# Altium schematic sheet Elreg_Sender_Top.SchDoc
size A; SheetNumber: 1
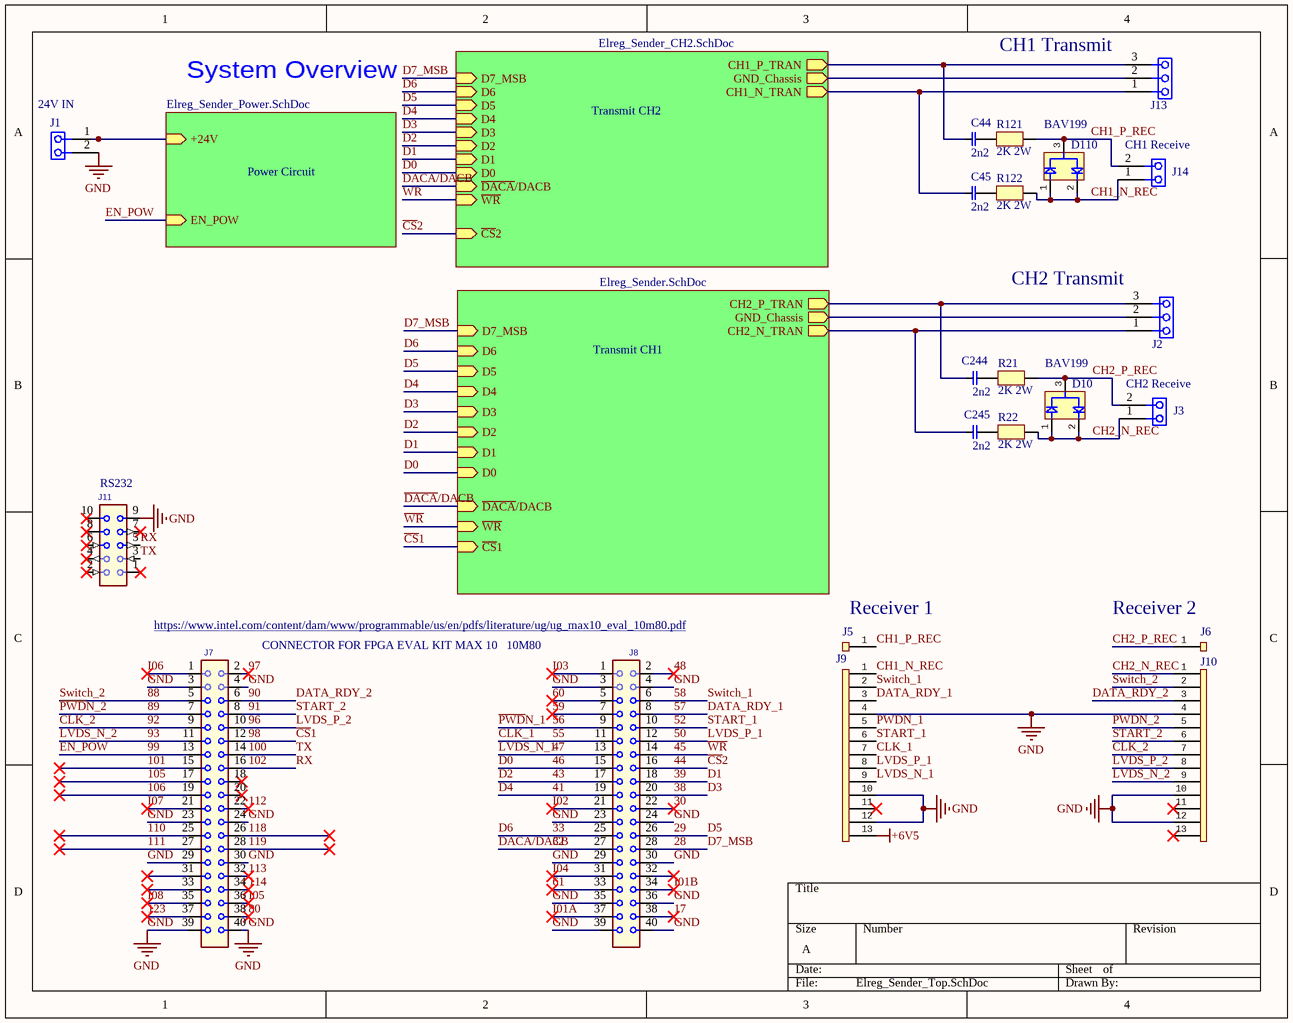
[diagram p0: Elreg_Sender_Top.SchDoc]

## Parts
C44  2n2  [CAP-1210]
C45  2n2  [CAP-1210]
C244  2n2  [CAP-1210]
C245  2n2  [CAP-1210]
D10  BAV199  [BAV199]
D110  BAV199  [BAV199]
J1  24V IN  [WAGO_2_pins]
J2  CONN 3x1  [WAGO-3_pins]  (value not drawn)
J3  CH2 Receive  [WAGO_2_pins]
J5  CON1_b  [CONN1 _b]  (value not drawn)
J6  CON1_b  [CONN1 _b]  (value not drawn)
J7  Header 2X20  [HEADER_2x20_2_54_1mm]  (value not drawn)
J8  Header 2X20  [HEADER_2x20_2_54_1mm]  (value not drawn)
J9  CON13  [CONN13]  (value not drawn)
J10  CON14  [CONN13]  (value not drawn)
J11  Header 2X5  [PIN-2X5-2.54-1.0]  (value not drawn)
J13  CONN 3x1  [WAGO-3_pins]  (value not drawn)
J14  CH1 Receive  [WAGO_2_pins]
R21  2K 2W  [RES2512]
R22  2K 2W  [RES2512]
R121  2K 2W  [RES2512]
R122  2K 2W  [RES2512]

## Sub-sheets
Power Circuit = Elreg_Sender_Power.SchDoc: +24V (in), EN_POW (in)
Transmit CH1 = Elreg_Sender.SchDoc: CH2_P_TRAN (out), CH2_N_TRAN (out), D0 (in), D1 (in), D2 (in), D3 (in), D4 (in), D5 (in), D6 (in), ~{CS}1 (in), ~{WR} (in), ~{DACA}/DACB (in), D7_MSB (in), GND_Chassis (out)
Transmit CH2 = Elreg_Sender_CH2.SchDoc: CH1_P_TRAN (out), CH1_N_TRAN (out), D0 (in), D1 (in), D2 (in), D3 (in), D4 (in), D5 (in), D6 (in), ~{WR} (in), ~{DACA}/DACB (in), D7_MSB (in), GND_Chassis (out), ~{CS}2 (in)

## Nets
+6V5: J9.13
GND: J1.2(Vout) J7.3(RX) J7.4(RTS) J7.23 J7.24 J7.29 J7.30 J7.39 J7.40 J8.3(RX) J8.4(RTS) J8.23 J8.24 J8.29 J8.30 J8.35 J8.36 J8.39 J8.40 J9.4 J9.10 J9.12 J10.4 J10.10 J10.12 J11.9(+PWR)
17: J8.38
28: J8.28 ; sheet Transmit CH1/D7_MSB, sheet Transmit CH2/D7_MSB  [also labelled D7_MSB]
29: J8.26 ; sheet Transmit CH1/D5, sheet Transmit CH2/D5  [also labelled D5]
30: J8.22
32: J8.27 ; sheet Transmit CH1/~{DACA}/DACB, sheet Transmit CH2/~{DACA}/DACB  [also labelled ~{DACA}/DACB]
33: J8.25 ; sheet Transmit CH1/D6, sheet Transmit CH2/D6  [also labelled D6]
38: J8.20 ; sheet Transmit CH1/D3, sheet Transmit CH2/D3  [also labelled D3]
39: J8.18 ; sheet Transmit CH1/D1, sheet Transmit CH2/D1  [also labelled D1]
41: J8.19 ; sheet Transmit CH1/D4, sheet Transmit CH2/D4  [also labelled D4]
43: J8.17 ; sheet Transmit CH1/D2, sheet Transmit CH2/D2  [also labelled D2]
44: J8.16 ; sheet Transmit CH2/~{CS}2  [also labelled ~{CS}2]
45: J8.14 ; sheet Transmit CH1/~{WR}, sheet Transmit CH2/~{WR}  [also labelled ~{WR}]
46: J8.15 ; sheet Transmit CH1/D0, sheet Transmit CH2/D0  [also labelled D0]
47: J8.13 J9.9  [also labelled LVDS_N_1]
48: J8.2(DSR)
50: J8.12 J9.8  [also labelled LVDS_P_1]
52: J8.10 J9.6  [also labelled START_1]
55: J8.11 J9.7  [also labelled CLK_1]
56: J8.9(+PWR) J9.5  [also labelled ~{PWD}N_1]
57: J8.8 J9.3  [also labelled DATA_RDY_1]
58: J8.6(CTS) J9.2  [also labelled Switch_1]
59: J8.7(DTR)
60: J8.5(TX)
61: J8.33
80: J7.38
88: J7.5(TX) J10.2  [also labelled Switch_2]
89: J7.7(DTR) J10.5  [also labelled ~{PWD}N_2]
90: J7.6(CTS) J10.3  [also labelled DATA_RDY_2]
91: J7.8 J10.6  [also labelled START_2]
92: J7.9(+PWR) J10.7  [also labelled CLK_2]
93: J7.11 J10.9  [also labelled LVDS_N_2]
96: J7.10 J10.8  [also labelled LVDS_P_2]
97: J7.2(DSR)
98: J7.12 ; sheet Transmit CH1/~{CS}1  [also labelled ~{CS}1]
99: J7.13 ; sheet Power Circuit/EN_POW  [also labelled EN_POW]
100: J7.14 J11.3(RX)  [also labelled TX]
101: J7.15
102: J7.16 J11.5(TX)  [also labelled RX]
105: J7.17
106: J7.19
110: J7.25
111: J7.27
112: J7.22
113: J7.32
114: J7.34
118: J7.26
119: J7.28
123: J7.37
CH1_N_REC: D110.1(GND) D110.2(GND) J9.1 J14.1(Vout) R122.1(G)
CH1_P_REC: D110.3(GND) J5.1 J14.2(Vout) R121.1(G)
CH2_N_REC: D10.1(GND) D10.2(GND) J3.1(Vout) J10.1 R22.1(G)
CH2_P_REC: D10.3(GND) J3.2(Vout) J6.1 R21.1(G)
I01A: J8.37
I01B: J8.34
I02: J8.21
I03: J8.1
I04: J8.31
I05: J7.36
I06: J7.1
I07: J7.21
I08: J7.35
NetC44_1: C44.1(G) J13.3(Vout) ; sheet Transmit CH2/CH1_P_TRAN
NetC44_2: C44.2(G) R121.2(G)
NetC45_1: C45.1(G) J13.1(Vout) ; sheet Transmit CH2/CH1_N_TRAN
NetC45_2: C45.2(G) R122.2(G)
NetC244_1: C244.1(G) J2.3(Vout) ; sheet Transmit CH1/CH2_P_TRAN
NetC244_2: C244.2(G) R21.2(G)
NetC245_1: C245.1(G) J2.1(Vout) ; sheet Transmit CH1/CH2_N_TRAN
NetC245_2: C245.2(G) R22.2(G)
NetJ1_1: J1.1(Vout) ; sheet Power Circuit/+24V
NetJ2_2: J2.2(Vout) ; sheet Transmit CH1/GND_Chassis
NetJ13_2: J13.2(Vout) ; sheet Transmit CH2/GND_Chassis

Not connected (* = marked no-connect by the designer): J7 18* 20* 31* 33*; J8 32*; J9 11(34)*; J10 11(34)* 13(36)*; J11 1* 2(DSR)* 4(RTS)* 6(CTS)* 7(DTR)* 8* 10*

## Notes on the sheet
- System Overview
- (near J13) CH1 Transmit
- (near J2) CH2 Transmit
- (near J11) RS232
- https://www.intel.com/content/dam/www/programmable/us/en/pdfs/literature/ug/ug_max10_eval_10m80.pdf
- (near J5) Receiver 1
- (near J6) Receiver 2
- (near J7) CONNECTOR FOR FPGA EVAL KIT MAX 10   10M80

## Library data of the parts
C44 C45 C244 C245 = C-1210: Manufacturer 1: Yageo; Manufacturer Part Number 1: CC1206KKX7RBBB332; Tolerance: ±10%; Voltage - Rated: 500V; Temperature Coefficient: X7R; Notification: Current market demand for these product types have resulted in fluctuating and extending lead times. Lead times may differ.; Description 1: CAP CER 3300PF 500V X7R 1206; Category 1: Capacitors; Packaging: Cut Tape (CT); Part Status: Active; Operating Temperature: -55°C ~ 125°C; Features: -; Ratings: -; Applications: General Purpose; Failure Rate: -; Mounting Type: Surface Mount, MLCC; Package / Case: 1206 (3216 Metric); Size / Dimension: 0.126" L x 0.063" W (3.20mm x 1.60mm); Height - Seated (Max): -; Thickness (Max): 0.057" (1.45mm); Lead Spacing: -; Lead Style: -; ComponentLink1URL: http://www.yageo.com/documents/recent/UPY-NP0X7R_MV_100-to-630V_21.pdf; ComponentLink1Description: http://www.yageo.com/documents/recent/UPY-NP0X7R_MV_100-to-630V_21.pdf; Supplier 1: Digi-Key; Supplier Part Number 1: 311-1506-1-ND; RoHS 1: RoHS Compliant; Stock 1: 4928; Pricing 1: 1=0.31, 10=0.214, 100=0.1085, 500=0.07424, 1000=0.06568 (USD)
J1 J3 J14 = 2x1 connector
J2 J13 = 3x1 connector
J7 J8 = HEADER_2x20_2.54_1: Manufacturer 1: TE Connectivity; Manufacturer Part Number 1: 826656-5; Description 1: Conn Unshrouded Header HDR 10 POS 2.54mm Solder ST Thru-Hole; Lead Time: 8 weeks; Peak Solder Temperature: 240 or 260 or 265 deg C; Supplier 1: Arrow; Supplier Part Number 1: 41579523S111189N5665; RoHS 1: CHINA ROHS: Compliant / EU ROHS: Compliant; Package Quantity: 4800; Termination Finish: Sn; EU_ROHS_PROD_EXEMPTION_BY_SUPP: N/R
J10 = CON13
J11 = HEADER_2x5_2.54: Conn Unshrouded Header HDR 10 POS 2.54mm Solder ST Thru-Hole; Manufacturer 1: TE Connectivity; Manufacturer Part Number 1: 826656-5; Lead Time: 8 weeks; Peak Solder Temperature: 240 or 260 or 265 deg C; Category 1: Connectors; Supplier 1: Arrow; Supplier Part Number 1: 41579523S111189N5665; RoHS 1: CHINA ROHS: Compliant / EU ROHS: Compliant; Description 1: Conn Unshrouded Header HDR 10 POS 2.54mm Solder ST Thru-Hole; Package Quantity: 4800; Termination Finish: Sn; EU_ROHS_PROD_EXEMPTION_BY_SUPP: N/R; ComponentLink1URL: http://components.arrow.com/partservice/dataview/altium/41579523S111189N5665?apiKey=aa438727d59eed98c4bed826d8d949c84cb5e685b92bf87346a0226bd2658797; ComponentLink1Description: http://components.arrow.com/partservice/dataview/altium/41579523S111189N5665?apiKey=aa438727d59eed98c4bed826d8d949c84cb5e685b92bf87346a0226bd2658797
R21 R22 R121 R122 = RES SMD 75K OHM 1% 2W 2512: Manufacturer 1: TE Connectivity Passive Product; Manufacturer Part Number 1: 352175KFT; Tolerance: ±1%; Temperature Coefficient: ±100ppm/°C; Category 1: Resistors; Packaging: Cut Tape (CT); Part Status: Active; Power (Watts): 2W; Composition: Thick Film; Features: -; Operating Temperature: -55°C ~ 155°C; Package / Case: 2512 (6432 Metric); Supplier Device Package: -; Size / Dimension: 0.248" L x 0.126" W (6.30mm x 3.20mm); Height - Seated (Max): 0.026" (0.65mm); Failure Rate: -; ComponentLink1URL: https://www.te.com/commerce/DocumentDelivery/DDEController?Action=srchrtrv&DocNm=9-1773463-5&DocType=DS&DocLang=English; ComponentLink1Description: https://www.te.com/commerce/DocumentDelivery/DDEController?Action=srchrtrv&DocNm=9-1773463-5&DocType=DS&DocLang=English; Supplier 1: Digi-Key; Supplier Part Number 1: A116077CT-ND; RoHS 1: RoHS Compliant; Description 1: RES SMD 75K OHM 1% 2W 2512; Stock 1: 1551; Pricing 1: 1=0.71, 10=0.521, 100=0.3037, 1000=0.17031 (USD)